# Altium schematic sheet MCU.SchDoc
size A; SheetNumber: 2; SheetTotal: 7
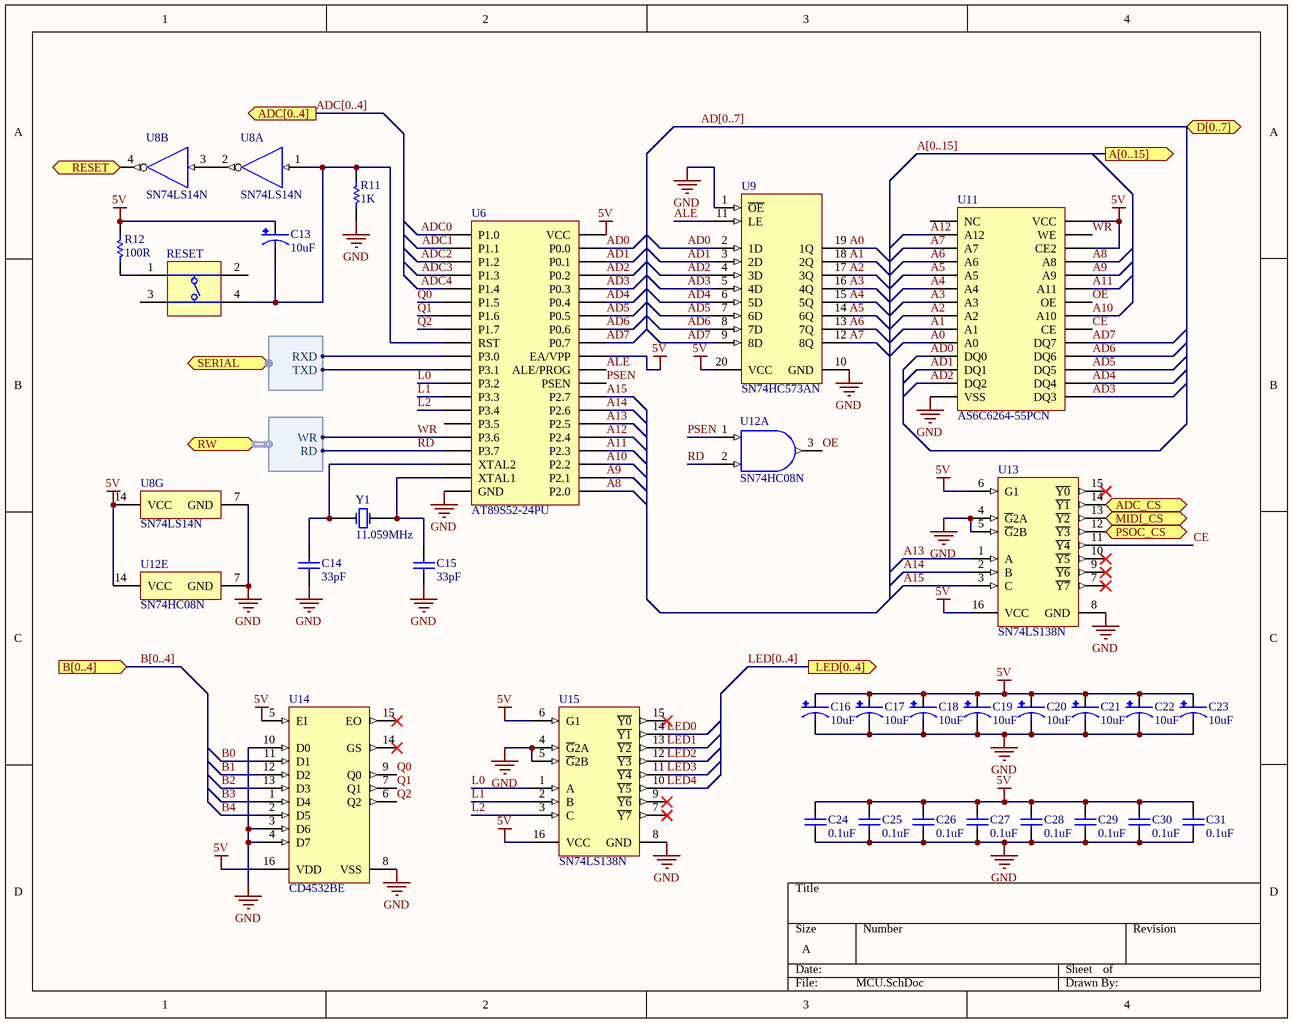
[diagram p0: MCU.SchDoc]

## Parts
C13  10uF  [CPOL-RADIAL]
C14  33pF  [CAP-PTH]
C15  33pF  [CAP-PTH]
C16  10uF  [CPOL-RADIAL]
C17  10uF  [CPOL-RADIAL]
C18  10uF  [CPOL-RADIAL]
C19  10uF  [CPOL-RADIAL]
C20  10uF  [CPOL-RADIAL]
C21  10uF  [CPOL-RADIAL]
C22  10uF  [CPOL-RADIAL]
C23  10uF  [CPOL-RADIAL]
C24  0.1uF  [CAP-PTH]
C25  0.1uF  [CAP-PTH]
C26  0.1uF  [CAP-PTH]
C27  0.1uF  [CAP-PTH]
C28  0.1uF  [CAP-PTH]
C29  0.1uF  [CAP-PTH]
C30  0.1uF  [CAP-PTH]
C31  0.1uF  [CAP-PTH]
R11  1K  [RESISTOR]
R12  100R  [RESISTOR]
RESET  (no value)  [TACTILE_SWITCH]
U6  AT89S52-24PU  [PDIP-40]
U8  SN74LS14N  [N0014A]  (parts A,B,G of 7)
U9  SN74HC573AN  [N0020A]
U11  AS6C6264-55PCN  [PDIP-28]
U12  SN74HC08N  [N0014A]  (parts A,E of 5)
U13  SN74LS138N  [N0016A]
U14  CD4532BE  [N0016A]
U15  SN74LS138N  [N0016A]
Y1  11.059MHz  [CRYSTAL_PTH]

## Ports
A[0..15] (out), ADC[0..4] (out), ADC_CS (out), B[0..4] (in), D[0..7] (bidir), LED[0..4] (out), MIDI_CS (out), PSOC_CS (out), RESET (out), RW (harness RW), SERIAL (harness UART)

## Harnesses
UART: RXD, TXD
RW: WR, RD

## Nets
5V: C13.1(+) C16.1(+) C17.1(+) C18.1(+) C19.1(+) C20.1(+) C21.1(+) C22.1(+) C23.1(+) C24.1 C25.1 C26.1 C27.1 C28.1 C29.1 C30.1 C31.1 R12.2 U6.31(EA/VPP) U6.40(VCC) U8.14(VCC) U9.20(VCC) U11.26(CE2) U11.28(VCC) U12.14(VCC) U13.6(G1) U13.16(VCC) U14.5(EI) U14.16(VDD) U15.6(G1) U15.16(VCC)
GND: C14.2 C15.2 C16.2(-) C17.2(-) C18.2(-) C19.2(-) C20.2(-) C21.2(-) C22.2(-) C23.2(-) C24.2 C25.2 C26.2 C27.2 C28.2 C29.2 C30.2 C31.2 R11.1 U6.20(GND) U8.7(GND) U9.1(~{OE}) U9.10(GND) U11.14(VSS) U12.7(GND) U13.4(~{G}2A) U13.5(~{G}2B) U13.8(GND) U14.3(D6) U14.4(D7) U14.8(VSS) U14.10(D0) U15.4(~{G}2A) U15.5(~{G}2B) U15.8(GND)
A0: U9.19(1Q) U11.10(A0)
A1: U9.18(2Q) U11.9(A1)
A2: U9.17(3Q) U11.8(A2)
A3: U9.16(4Q) U11.7(A3)
A4: U9.15(5Q) U11.6(A4)
A5: U9.14(6Q) U11.5(A5)
A6: U9.13(7Q) U11.4(A6)
A7: U9.12(8Q) U11.3(A7)
A8: U6.21(P2.0) U11.25(A8)
A9: U6.22(P2.1) U11.24(A9)
A10: U6.23(P2.2) U11.21(A10)
A11: U6.24(P2.3) U11.23(A11)
A12: U6.25(P2.4) U11.2(A12)
A13: U6.26(P2.5) U13.1(A)
A14: U6.27(P2.6) U13.2(B)
A15: U6.28(P2.7) U13.3(C)
AD0: U6.39(P0.0) U9.2(1D) U11.11(DQ0)
AD1: U6.38(P0.1) U9.3(2D) U11.12(DQ1)
AD2: U6.37(P0.2) U9.4(3D) U11.13(DQ2)
AD3: U6.36(P0.3) U9.5(4D) U11.15(DQ3)
AD4: U6.35(P0.4) U9.6(5D) U11.16(DQ4)
AD5: U6.34(P0.5) U9.7(6D) U11.17(DQ5)
AD6: U6.33(P0.6) U9.8(7D) U11.18(DQ6)
AD7: U6.32(P0.7) U9.9(8D) U11.19(DQ7)
ADC0: U6.1(P1.0)
ADC1: U6.2(P1.1)
ADC2: U6.3(P1.2)
ADC3: U6.4(P1.3)
ADC4: U6.5(P1.4)
ADC_CS: U13.14(~{Y1}) ; port ADC_CS
ALE: U6.30(ALE/PROG) U9.11(LE)
B0: U14.11(D1)
B1: U14.12(D2)
B2: U14.13(D3)
B3: U14.1(D4)
B4: U14.2(D5)
CE: U11.20(CE) U13.11(~{Y4})
L0: U6.12(P3.2) U15.1(A)
L1: U6.13(P3.3) U15.2(B)
L2: U6.14(P3.4) U15.3(C)
LED0: U15.14(~{Y1})
LED1: U15.13(~{Y2})
LED2: U15.12(~{Y3})
LED3: U15.11(~{Y4})
LED4: U15.10(~{Y5})
MIDI_CS: U13.13(~{Y2}) ; port MIDI_CS
OE: U11.22(OE) U12.3(1Y)
PSEN: U6.29(PSEN) U12.1(1A)
PSOC_CS: U13.12(~{Y3}) ; port PSOC_CS
Q0: U6.6(P1.5) U14.9(Q0)
Q1: U6.7(P1.6) U14.7(Q1)
Q2: U6.8(P1.7) U14.6(Q2)
RD: U6.17(P3.7) U12.2(1B) ; port RW.RD
RESET: U8.4(~{2Y}) ; port RESET
WR: U6.16(P3.6) U11.27(WE) ; port RW.WR
NetC13_2: C13.2(-) R11.2 RESET.4(T3) U6.9(RST) U8.1(1A)
NetC14_1: C14.1 U6.18(XTAL2) Y1.1(X1)
NetC15_1: C15.1 U6.19(XTAL1) Y1.2(X2)
NetR12_1: R12.1 RESET.1(T1)
NetU6_10: U6.10(P3.0) ; port SERIAL.RXD
NetU6_11: U6.11(P3.1) ; port SERIAL.TXD
NetU8_2: U8.2(~{1Y}) U8.3(2A)

Not connected (* = marked no-connect by the designer): RESET 2(T2) 3(T3); U6 15(P3.5); U11 1(NC); U13 7(~{Y7})* 9(~{Y6})* 10(~{Y5})* 15(~{Y0})*; U14 14(GS)* 15(EO)*; U15 7(~{Y7})* 9(~{Y6})* 15(~{Y0})*

## Buses and harness runs
bus A[0..15] = port A[0..15]
bus AD[0..7] = port D[0..7]
bus ADC[0..4] = port ADC[0..4]
bus B[0..4] = port B[0..4]
bus LED[0..4] = port LED[0..4]

## Library data of the parts
C13 C16-C23 = PolarizedCap
C14 C15 C24-C31 = Cap
R11 R12 = Resistor
RESET = Switch: Switch, SPNO Push Button SMD
U6 = AT89S52-24PU: Manufacturer: Atmel; PartNumber: AT89S52-24PU; Mounting Technology: Through Hole; PackageReference: PDIP-40
U8 = CMP-1615-00069-3: Hex schmitt-trigger inverters, N0014A, TUBE; Manufacturer: Texas Instruments; VCC(Max)(V): 5.25; F @ Nom Voltage(Max)(Mhz): 35; Bits(#): 6; Schmitt Trigger: Yes; Rating: Catalog; Output Type: CMOS; Voltage(Nom)(V): 5; Technology Family: LS; VCC(Min)(V): 4.75; Output Drive (IOL/IOH)(Max)(mA): -0.4/8; tpd @ Nom Voltage(Max)(ns): 22; Input Type: TTL; ICC @ Nom Voltage(Max)(mA): 0.06; Code_JEDEC: MS-001; DatasheetVersion: SDLS049B; PackageReference: N0014A; Operating Temperature Range(C): 0 to 70; Generic Part Number: SN74LS14
U9 = CMP-1621-00367-2: Octal Transparent D-Type Latches With 3-State Outputs, N0020A, TUBE; Manufacturer: Texas Instruments; Rating: Catalog; ICC @ Nom Voltage(Max)(mA): 0.08; Logic: True; tpd @ Nom Voltage(Max)(ns): 38; F @ Nom Voltage(Max)(Mhz): 28; Output Logic: Non-inverted; Bits(#): 8; VCC(Max)(V): 6; Output Type: CMOS; VCC(Min)(V): 2; Technology Family: HC; Schmitt Trigger: No; 3-State Output: Yes; Output Drive (IOL/IOH)(Max)(mA): 7.8/-7.8; DatasheetVersion: SCLS147E; PackageReference: N0020A; Operating Temperature Range(C): -40 to 85; Static Current: 0.08; Code_JEDEC: MS-001; Voltage(Nom)(V): 6; Generic Part Number: SN74HC573A; Input Type: CMOS
U11 = AS6C6264-55PCN: Manufacturer: Alliance Memory, Inc.; PartNumber: AS6C6264-55PCN; Mounting Technology: Through Hole; PackageReference: PDIP-28
U12 = CMP-0777-00250-3: Quadruple 2-Input Positive-AND Gates, N0014A, TUBE; Manufacturer: Texas Instruments; Output Type: CMOS; ICC @ Nom Voltage(Max)(mA): 0.02; tpd @ Nom Voltage(Max)(ns): 28; Voltage(Nom)(V): 5; VCC(Min)(V): 2; Technology Family: HC; F @ Nom Voltage(Max)(Mhz): 70; Rating: Catalog; Bits(#): 4; Schmitt Trigger: No; VCC(Max)(V): 6; PackageReference: N0014A; Input Type: CMOS; Generic Part Number: SN74HC08; DatasheetVersion: SCLS081F; Operating Temperature Range(C): -40 to 85
U13 U15 = CMP-1633-00714-2: 3-line to 8-line decoder / demultiplexer, N0016A, TUBE; Manufacturer: Texas Instruments; Voltage(Nom)(V): 5; VCC(Min)(V): 4.75; Schmitt Trigger: No; Bits(#): 8; VCC(Max)(V): 5.25; ICC @ Nom Voltage(Max)(mA): 10; F @ Nom Voltage(Max)(Mhz): 35; Channels(#): 1; Configuration: 3：8; Technology Family: LS; Output Type: TTL; Output Drive (IOL/IOH)(Max)(mA): 8/-0.4; tpd @ Nom Voltage(Max)(ns): 41; Rating: Catalog; Operating Temperature Range(C): 0 to 70; PackageReference: N0016A; DatasheetVersion: SDLS014; Type: Standard; Generic Part Number: SN74LS138; Function: Decoder/Demultiplexer; Input Type: TTL; Code_JEDEC: MS-001
U14 = CMP-1633-00642-2: CMOS 8-Bit Priority Encoder, N0016A, TUBE; Manufacturer: Texas Instruments; Schmitt Trigger: No; Technology Family: CD4000; Rating: Catalog; Bits(#): 8; VCC(Min)(V): 3; ICC @ Nom Voltage(Max)(mA): 0.3; Function: Encoder/Multiplexer; Configuration: 8：4; Output Drive (IOL/IOH)(Max)(mA): 1.5/-1.5; tpd @ Nom Voltage(Max)(ns): 110; Channels(#): 1; VCC(Max)(V): 18; Voltage(Nom)(V): 5,10,15; Generic Part Number: CD4532B; Code_JEDEC: MS-001; F @ Nom Voltage(Max)(Mhz): 8; PackageReference: N0016A; Operating Temperature Range(C): -55 to 125; Type: Standard; DatasheetVersion: SCHS082C; Input Type: CMOS; Output Type: CMOS
Y1 = Crystal